# Altium schematic sheet optInput.SchDoc
size 420 x 297 mm; Scale: 1:1; DocumentType: Схема электрическая принципиальная; FirstReferrence: АБВГ.123456.001
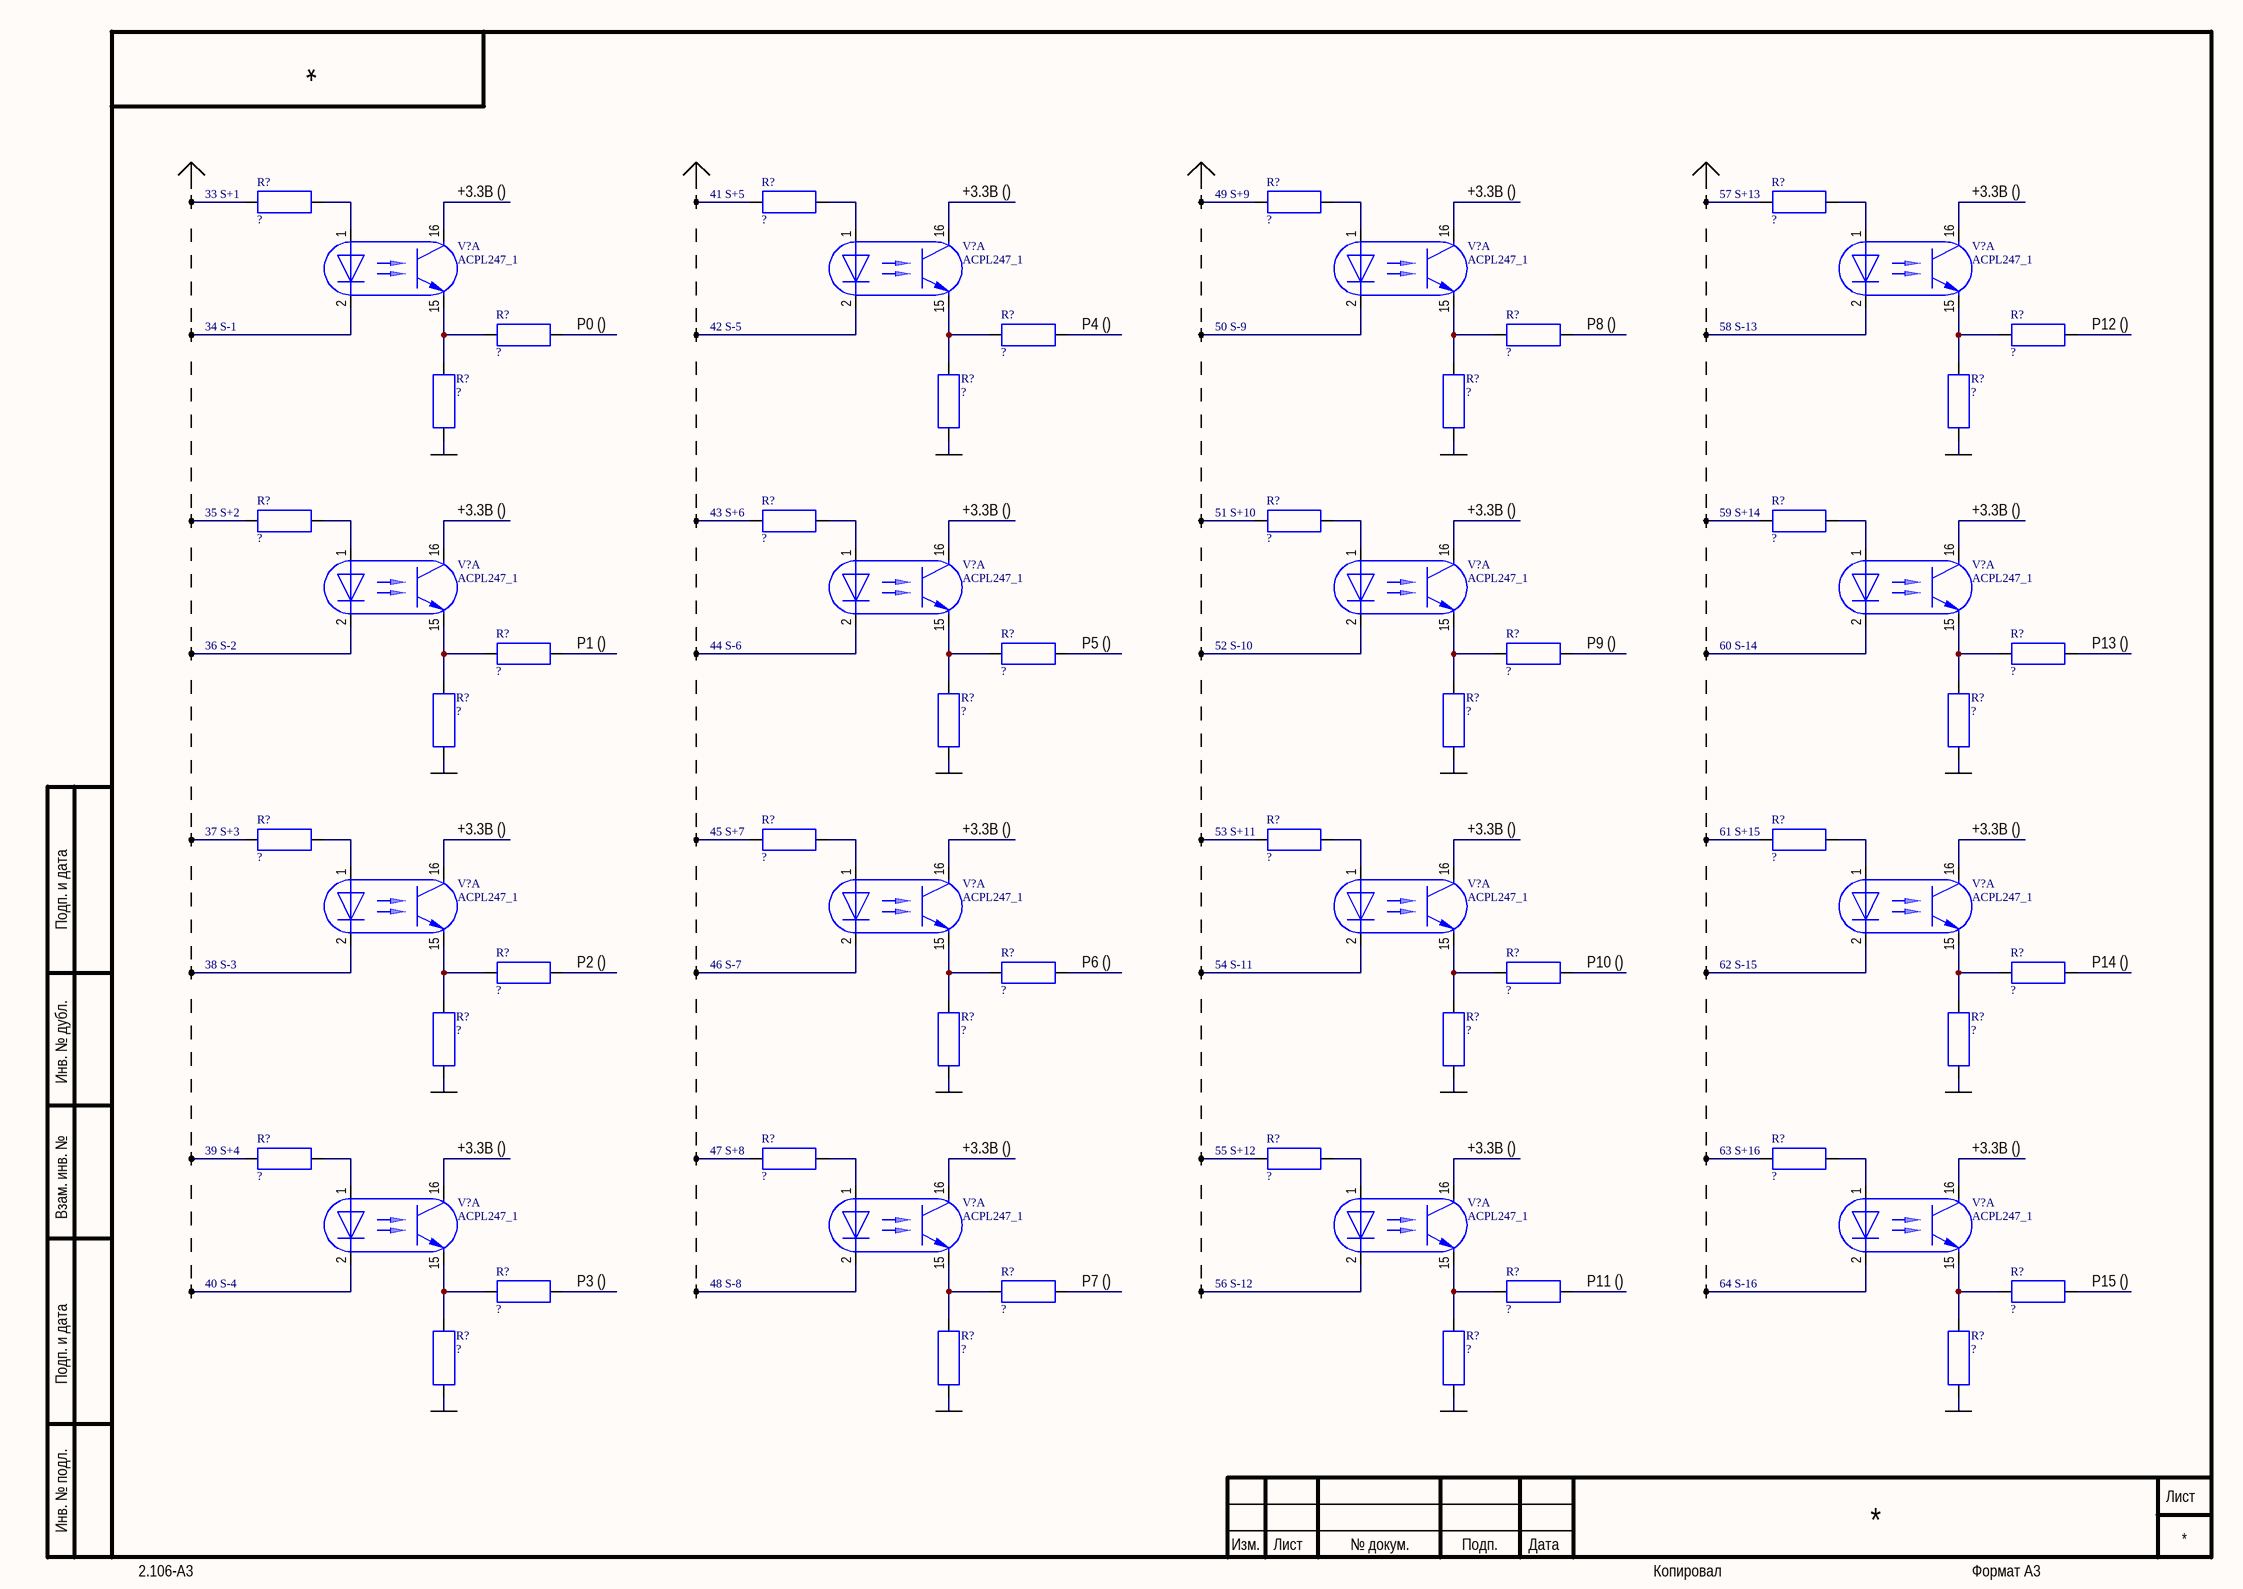
[diagram p0: optInput.SchDoc]

## Parts
(Parts that share a designator on the sheet are numbered #1, #2 ... from top to bottom, then left to right.)
R?#1  ?  [RES0805]
R?#2  ?  [RES0805]
R?#3  ?  [RES0805]
R?#4  ?  [RES0805]
R?#5  ?  [RES0805]
R?#6  ?  [RES0805]
R?#7  ?  [RES0805]
R?#8  ?  [RES0805]
R?#9  ?  [RES0805]
R?#10  ?  [RES0805]
R?#11  ?  [RES0805]
R?#12  ?  [RES0805]
R?#13  ?  [RES0805]
R?#14  ?  [RES0805]
R?#15  ?  [RES0805]
R?#16  ?  [RES0805]
R?#17  ?  [RES0805]
R?#18  ?  [RES0805]
R?#19  ?  [RES0805]
R?#20  ?  [RES0805]
R?#21  ?  [RES0805]
R?#22  ?  [RES0805]
R?#23  ?  [RES0805]
R?#24  ?  [RES0805]
R?#25  ?  [RES0805]
R?#26  ?  [RES0805]
R?#27  ?  [RES0805]
R?#28  ?  [RES0805]
R?#29  ?  [RES0805]
R?#30  ?  [RES0805]
R?#31  ?  [RES0805]
R?#32  ?  [RES0805]
R?#33  ?  [RES0805]
R?#34  ?  [RES0805]
R?#35  ?  [RES0805]
R?#36  ?  [RES0805]
R?#37  ?  [RES0805]
R?#38  ?  [RES0805]
R?#39  ?  [RES0805]
R?#40  ?  [RES0805]
R?#41  ?  [RES0805]
R?#42  ?  [RES0805]
R?#43  ?  [RES0805]
R?#44  ?  [RES0805]
R?#45  ?  [RES0805]
R?#46  ?  [RES0805]
R?#47  ?  [RES0805]
R?#48  ?  [RES0805]
V?#1  ACPL247_1  [SOP127P700X220-16N]  (part A of 4)
V?#2  ACPL247_1  [SOP127P700X220-16N]  (part A of 4)
V?#3  ACPL247_1  [SOP127P700X220-16N]  (part A of 4)
V?#4  ACPL247_1  [SOP127P700X220-16N]  (part A of 4)
V?#5  ACPL247_1  [SOP127P700X220-16N]  (part A of 4)
V?#6  ACPL247_1  [SOP127P700X220-16N]  (part A of 4)
V?#7  ACPL247_1  [SOP127P700X220-16N]  (part A of 4)
V?#8  ACPL247_1  [SOP127P700X220-16N]  (part A of 4)
V?#9  ACPL247_1  [SOP127P700X220-16N]  (part A of 4)
V?#10  ACPL247_1  [SOP127P700X220-16N]  (part A of 4)
V?#11  ACPL247_1  [SOP127P700X220-16N]  (part A of 4)
V?#12  ACPL247_1  [SOP127P700X220-16N]  (part A of 4)
V?#13  ACPL247_1  [SOP127P700X220-16N]  (part A of 4)
V?#14  ACPL247_1  [SOP127P700X220-16N]  (part A of 4)
V?#15  ACPL247_1  [SOP127P700X220-16N]  (part A of 4)
V?#16  ACPL247_1  [SOP127P700X220-16N]  (part A of 4)
X?#1  33 S+1  [PLD64]  (part 33 of 64)
X?#2  41 S+5  [PLD64]  (part 41 of 64)
X?#3  49 S+9  [PLD64]  (part 49 of 64)
X?#4  57 S+13  [PLD64]  (part 57 of 64)
X?#5  34 S-1  [PLD64]  (part 34 of 64)
X?#6  42 S-5  [PLD64]  (part 42 of 64)
X?#7  50 S-9  [PLD64]  (part 50 of 64)
X?#8  58 S-13  [PLD64]  (part 58 of 64)
X?#9  35 S+2  [PLD64]  (part 35 of 64)
X?#10  43 S+6  [PLD64]  (part 43 of 64)
X?#11  51 S+10  [PLD64]  (part 51 of 64)
X?#12  59 S+14  [PLD64]  (part 59 of 64)
X?#13  36 S-2  [PLD64]  (part 36 of 64)
X?#14  44 S-6  [PLD64]  (part 44 of 64)
X?#15  52 S-10  [PLD64]  (part 52 of 64)
X?#16  60 S-14  [PLD64]  (part 60 of 64)
X?#17  37 S+3  [PLD64]  (part 37 of 64)
X?#18  45 S+7  [PLD64]  (part 45 of 64)
X?#19  53 S+11  [PLD64]  (part 53 of 64)
X?#20  61 S+15  [PLD64]  (part 61 of 64)
X?#21  38 S-3  [PLD64]  (part 38 of 64)
X?#22  46 S-7  [PLD64]  (part 46 of 64)
X?#23  54 S-11  [PLD64]  (part 54 of 64)
X?#24  62 S-15  [PLD64]  (part 62 of 64)
X?#25  39 S+4  [PLD64]  (part 39 of 64)
X?#26  47 S+8  [PLD64]  (part 47 of 64)
X?#27  55 S+12  [PLD64]  (part 55 of 64)
X?#28  63 S+16  [PLD64]  (part 63 of 64)
X?#29  40 S-4  [PLD64]  (part 40 of 64)
X?#30  48 S-8  [PLD64]  (part 48 of 64)
X?#31  56 S-12  [PLD64]  (part 56 of 64)
X?#32  64 S-16  [PLD64]  (part 64 of 64)

## Nets
NetR?#1_1: R?#1.1 X?#1.8
NetR?#1_2: R?#1.2 V?#1.1
NetR?#2_1: R?#2.1 X?#2.33
NetR?#2_2: R?#2.2 V?#2.1
NetR?#3_1: R?#3.1 X?#3.25
NetR?#3_2: R?#3.2 V?#3.1
NetR?#4_1: R?#4.1 X?#4.16
NetR?#4_2: R?#4.2 V?#4.1
NetR?#5_1: R?#5.1 R?#9.2 V?#1.15
NetR?#6_1: R?#6.1 R?#10.2 V?#2.15
NetR?#7_1: R?#7.1 R?#11.2 V?#3.15
NetR?#8_1: R?#8.1 R?#12.2 V?#4.15
NetR?#13_1: R?#13.1 X?#9.24
NetR?#13_2: R?#13.2 V?#5.1
NetR?#14_1: R?#14.1 X?#10.37
NetR?#14_2: R?#14.2 V?#6.1
NetR?#15_1: R?#15.1 X?#11.10
NetR?#15_2: R?#15.2 V?#7.1
NetR?#16_1: R?#16.1 X?#12.18
NetR?#16_2: R?#16.2 V?#8.1
NetR?#17_1: R?#17.1 R?#21.2 V?#5.15
NetR?#18_1: R?#18.1 R?#22.2 V?#6.15
NetR?#19_1: R?#19.1 R?#23.2 V?#7.15
NetR?#20_1: R?#20.1 R?#24.2 V?#8.15
NetR?#25_1: R?#25.1 X?#17.28
NetR?#25_2: R?#25.2 V?#9.1
NetR?#26_1: R?#26.1 X?#18.40
NetR?#26_2: R?#26.2 V?#10.1
NetR?#27_1: R?#27.1 X?#19.12
NetR?#27_2: R?#27.2 V?#11.1
NetR?#28_1: R?#28.1 X?#20.20
NetR?#28_2: R?#28.2 V?#12.1
NetR?#29_1: R?#29.1 R?#33.2 V?#9.15
NetR?#30_1: R?#30.1 R?#34.2 V?#10.15
NetR?#31_1: R?#31.1 R?#35.2 V?#11.15
NetR?#32_1: R?#32.1 R?#36.2 V?#12.15
NetR?#37_1: R?#37.1 X?#25.30
NetR?#37_2: R?#37.2 V?#13.1
NetR?#38_1: R?#38.1 X?#26.44
NetR?#38_2: R?#38.2 V?#14.1
NetR?#39_1: R?#39.1 X?#27.14
NetR?#39_2: R?#39.2 V?#15.1
NetR?#40_1: R?#40.1 X?#28.22
NetR?#40_2: R?#40.2 V?#16.1
NetR?#41_1: R?#41.1 R?#45.2 V?#13.15
NetR?#42_1: R?#42.1 R?#46.2 V?#14.15
NetR?#43_1: R?#43.1 R?#47.2 V?#15.15
NetR?#44_1: R?#44.1 R?#48.2 V?#16.15
NetV?#1_2: V?#1.2 X?#5.9
NetV?#2_2: V?#2.2 X?#6.35
NetV?#3_2: V?#3.2 X?#7.26
NetV?#4_2: V?#4.2 X?#8.17
NetV?#5_2: V?#5.2 X?#13.27
NetV?#6_2: V?#6.2 X?#14.38
NetV?#7_2: V?#7.2 X?#15.11
NetV?#8_2: V?#8.2 X?#16.19
NetV?#9_2: V?#9.2 X?#21.29
NetV?#10_2: V?#10.2 X?#22.42
NetV?#11_2: V?#11.2 X?#23.13
NetV?#12_2: V?#12.2 X?#24.21
NetV?#13_2: V?#13.2 X?#29.31
NetV?#14_2: V?#14.2 X?#30.46
NetV?#15_2: V?#15.2 X?#31.15
NetV?#16_2: V?#16.2 X?#32.23

Not connected (* = marked no-connect by the designer): R?#5 2; R?#6 2; R?#7 2; R?#8 2; R?#9 1; R?#10 1; R?#11 1; R?#12 1; R?#17 2; R?#18 2; R?#19 2; R?#20 2; R?#21 1; R?#22 1; R?#23 1; R?#24 1; R?#29 2; R?#30 2; R?#31 2; R?#32 2; R?#33 1; R?#34 1; R?#35 1; R?#36 1; R?#41 2; R?#42 2; R?#43 2; R?#44 2; R?#45 1; R?#46 1; R?#47 1; R?#48 1; V?#1 16; V?#2 16; V?#3 16; V?#4 16; V?#5 16; V?#6 16; V?#7 16; V?#8 16; V?#9 16; V?#10 16; V?#11 16; V?#12 16; V?#13 16; V?#14 16; V?#15 16; V?#16 16

## Notes on the sheet
- (near V?#1) +3.3В ()
- (near V?#2) +3.3В ()
- (near V?#3) +3.3В ()
- (near V?#4) +3.3В ()
- (near R?#5) P0 ()
- (near R?#6) P4 ()
- (near R?#7) P8 ()
- (near R?#8) P12 ()
- (near V?#5) +3.3В ()
- (near V?#6) +3.3В ()
- (near V?#7) +3.3В ()
- (near V?#8) +3.3В ()
- (near R?#17) P1 ()
- (near R?#18) P5 ()
- (near R?#19) P9 ()
- (near R?#20) P13 ()
- (near V?#9) +3.3В ()
- (near V?#10) +3.3В ()
- (near V?#11) +3.3В ()
- (near V?#12) +3.3В ()
- (near R?#29) P2 ()
- (near R?#30) P6 ()
- (near R?#31) P10 ()
- (near R?#32) P14 ()
- (near V?#13) +3.3В ()
- (near V?#14) +3.3В ()
- (near V?#15) +3.3В ()
- (near V?#16) +3.3В ()
- (near R?#41) P3 ()
- (near R?#42) P7 ()
- (near R?#43) P11 ()
- (near R?#44) P15 ()
- Подп. и дата
- Инв. № дубл.
- Взам. инв. №
- Инв. № подл.
- Изм.
- Лист
- № докум.
- Подп.
- Дата
- 2.106-A3
- Копировал
- Формат А3

## Library data of the parts
R?#1-R?#48 = R_1
X?#1-X?#32 = PLD64